# EAGLE design Kinetic_reva (EAGLE 7.7.0)
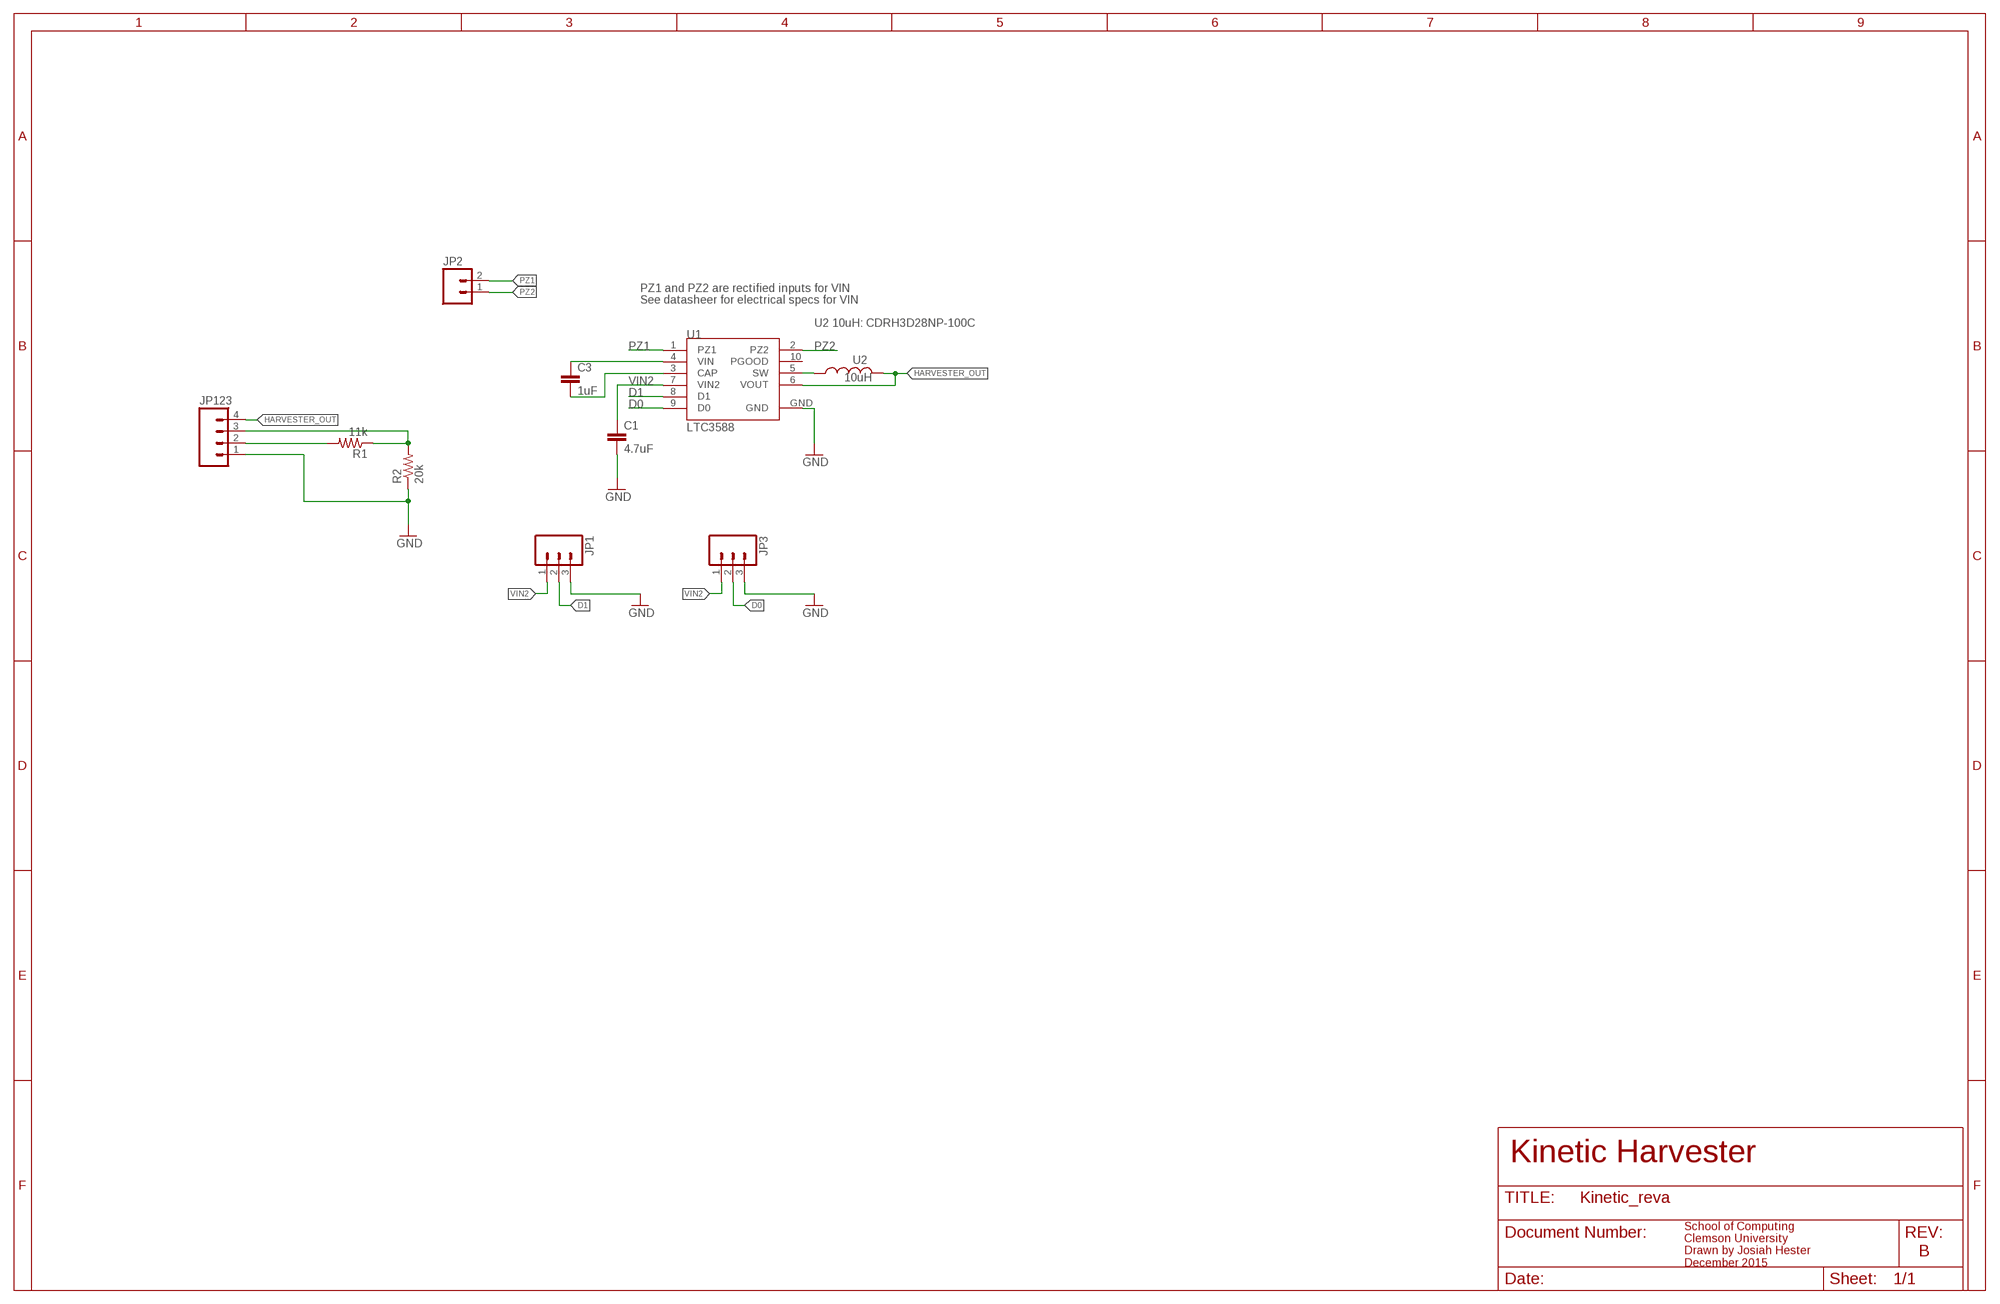
[diagram p0: schematic, sheet 1]

## Parts
C1  4.7uF  CAP0402-CAP  [0402-CAP]
C3  1uF  CAP0402-CAP  [0402-CAP]
JP1  M03  [1X03-1.27MM]
JP2  M02LOCK  [1X02_LOCK]
JP3  M03  [1X03-1.27MM]
JP123  M041.27MM  [1X04-1.27MM]
R1  11k  R-EU0603  [0603]
R2  20k  R-EU0603  [0603]
U1  LTC3588  LTC3588_  [MSOP-10-GNDPAD]
U2  10uH  INDUCTOR-  [CDRH3D28]

## Nets
D0: JP3.2 U1.9(D0)
D1: JP1.2 U1.8(D1)
GND: C1.2 JP1.3 JP3.3 JP123.1 R2.1 U1.GND
HARVESTER_OUT: JP123.4 U1.6(VOUT) U2.2
N$1: JP123.3 R1.1 R2.2
N$2: JP123.2 R1.2
N$3: C3.2 U1.3(CAP)
N$6: U1.5(SW) U2.1
PZ1: JP2.2 U1.1(PZ1)
PZ2: JP2.1 U1.2(PZ2)
VIN: C3.1 U1.4(VIN)
VIN2: C1.1 JP1.1 JP3.1 U1.7(VIN2)
Unconnected: U1.10(PGOOD)

## Notes on the sheet
- PZ1 and PZ2 are rectified inputs for VIN
- See datasheer for electrical specs for VIN
- U2 10uH: CDRH3D28NP-100C
- Kinetic Harvester
- B
- School of Computing
  Clemson University
  Drawn by Josiah Hester
  December 2015

## Library data of the parts
C1 = SparkFun:CAP: Capacitor Standard 0603 ceramic capacitor, and 0.1" leaded capacitor.; MPN: C1005X5R1A475M050BC
C3 = SparkFun:CAP: Capacitor Standard 0603 ceramic capacitor, and 0.1" leaded capacitor.; MPN: 0402ZD105KAT2A
JP1 JP3 = SparkFun-Connectors:M03: Header 3 Standard 3-pin 0.1" header. Use with straight break away headers (SKU : PRT-00116), right angle break away headers (PRT-00553), swiss pins (PRT-00743), machine pins (PRT-00117), and female headers (PRT-00115). Molex polarized connector foot print use with SKU : PRT-08232 with associated crimp pins and housings.; MPN: GRPB031VWVN-RC
JP2 = SparkFun-Connectors:M02: Standard 2-pin 0.1" header. Use with - straight break away headers ( PRT-00116) - right angle break away headers (PRT-00553) - swiss pins (PRT-00743) - machine pins (PRT-00117) - female headers (PRT-00115) Molex polarized connector foot print use with: PRT-08233 with associated crimp pins and housings. 2.54_SCREWTERM for use with PRT-10571. 3.5mm Screw Terminal footprints for PRT-08084 5mm Screw Terminal footprints for use with PRT-08432
JP123 = SparkFun-Connectors:M04: Header 4 Standard 4-pin 0.1" header. Use with straight break away headers (SKU : PRT-00116), right angle break away headers (PRT-00553), swiss pins (PRT-00743), machine pins (PRT-00117), and female headers (PRT-00115). Molex polarized connector foot print use with SKU : PRT-08231 with associated crimp pins and housings. 1MM SMD Version SKU: PRT-10208; MPN: GRPB041VWVN-RC
R1 = tiny_passives:R-EU; MPN: RC0603JR-0711KL
R2 = tiny_passives:R-EU; MPN: CRCW060320K0FKEA
U1 = SparkFun:LTC3588: LTC3588 Energy Harvesting Power Supply; DIGIKEY: LTC3588EMSE-1#PBF-ND; MPN: LTC3588EMSE-1#PBF
U2 = SparkFun:INDUCTOR: Inductors Basic Inductor/Choke - 0603 and 1206. Footprints are not proven and vary greatly between part numbers.; DIGIKEY: 308-2298-1-ND; MPN: CDRH3D16NP-100NC

## Board
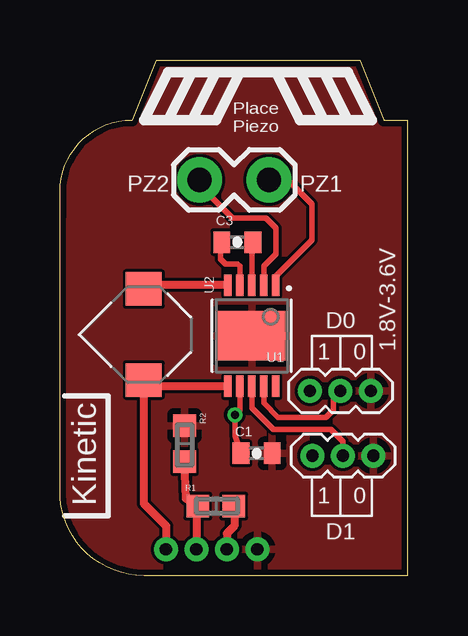
[diagram p1: board, top side]
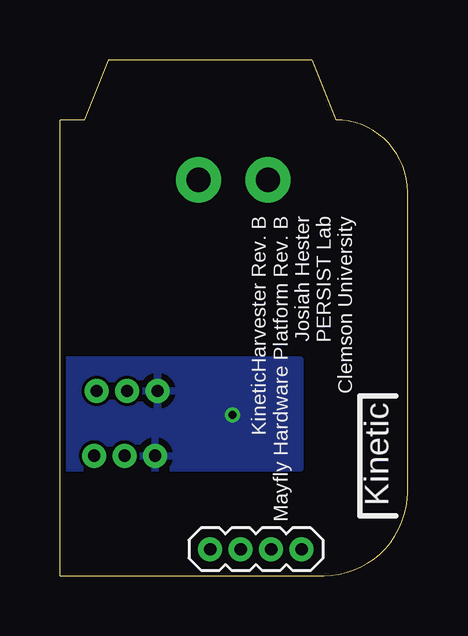
[diagram p2: board, bottom side, seen from below]

Size 14.5 x 21.5 mm. Coordinates in mm from the lower left corner, seen from the top.
Outline: 14.5,0 3.5,0 arc-90 0,3.5 0,15 0,16 arc-90 3,19 4,21.5 12.5,21.5 13.5,19 14.5,19 14.5,0
Copper layers (1*16): Top 0.035mm / dielectric 1.5mm / Bottom 0.035mm
Design rules "MF_Standard_2_Layer": minimum track width 5mil, minimum drill 12mil, track to track 5mil, track to pad 5mil, pad to pad 5mil, via to via 5mil, smd to smd 0mil, copper to edge 10mil, drill to drill 10mil, minimum pad ring 6mil, minimum via ring 6mil, stop-mask expansion 2mil, vias tented up to drill 25mil, thermal gap 10mil

### Footprints (pad centres in the part's own frame; a part is rotated, then mirrored left to right if it is on the bottom)
0402-CAP = smd 0.7 x 0.9: 1 -0.65,0; 2 0.65,0
1X03-1.27MM = drill 0.508 pad 1: 1 -1.27,0; 2 0,0; 3 1.27,0
1X02_LOCK = drill 1.016 pad 1.88: 1 -0.178,0; 2 2.718,0
1X04-1.27MM = drill 0.508 pad 1: 1 0,0; 2 1.27,0; 3 2.54,0; 4 3.81,0
0603 = smd 0.95 x 0.95: 1 -0.75,0; 2 0.75,0
MSOP-10-GNDPAD = smd 0.305 x 0.889: 1 -1,-2.11; 2 -0.5,-2.11; 3 0,-2.11; 4 0.5,-2.11; 5 1,-2.11; 6 1,2.11; 7 0.5,2.11; 8 0,2.11; 9 -0.5,2.11; 10 -1,2.11 | smd 2.794 x 2.083: GND 0,0
CDRH3D28 = smd 1.4 x 1.5: 1 -1.95,-0.007; 2 1.849,-0.007

### Placement (x,y rotation side)
C1  8.2,5.1 0 top
C3  7.4,13.9 0 top
JP1  11.8,5 0 top
JP2  6,16.5 0 top
JP3  11.7,7.7 0 top
JP123  8.23,1.1 0 bottom
R1  6.5,2.9 0 top
R2  5.2,5.5 270 top
U1  8,10 180 top
U2  3.5,10 270 top

### Tracks (layer width: path | path; a pad name or v marks a point on that pad's centre or on a via)
D0
  Top 0.222: U1.9 8.5,7.2 9.1,6.6 11.1,6.6 11.4,6.9 11.4,7.4 JP3.2
D1
  Top 0.222: JP1.2 11.8,5.6 11.3,6.1 8.9,6.1 8,7 U1.8
GND
  pour Top: 0,-0.5 14.5,-0.5 15,22 0,22
HARVESTER_OUT
  Top 0.333: U1.6 3.75,7.89 U2.2 3.5,3 4.44,2.06 4.42,2.04 JP123.4
N$1
  Top 0.333: R2.2 5.25,3.2 R1.1 5.69,2.84 JP123.3
N$2
  Top 0.333: R1.2 7.3,2.85 7.3,2.1 6.96,1.76 JP123.2
N$3
  Top 0.222: U1.3 8,13.85 C3.2
N$6
  Top 0.333: U1.5 3.65,12.11 U2.1
PZ1
  Top 0.222: U1.1 9,12.5 10.5,14 10.5,15.5 9.5,16.5 JP2.2
PZ2
  Top 0.222: U1.2 8.5,12.9 9,13.4 9,14.5 8.6,14.9 7.2,14.9 5.82,16.28 JP2.1
VIN
  Top 0.222: U1.4 7.5,12.9 7.4,13 6.9,13 6.7,13.2 6.7,13.85 C3.1
VIN2  (via drill 0.33)
  Top 0.222: U1.7 7.5,6.9 v7.3,6.7 7.3,5.85 C1.1
  pour Bottom: 4.5,4.5 14.5,4.5 14.5,9 4.5,9

### Text on the board
tPlace: Place / Piezo | PZ2 | PZ1 | 1.8V-3.6V | D0 | 1 | 0 | 1 | 0 | Kinetic | D1
bPlace: KineticHarvester Rev. B / Mayfly Hardware Platform Rev. B / Josiah Hester / PERSIST Lab / Clemson University | Kinetic